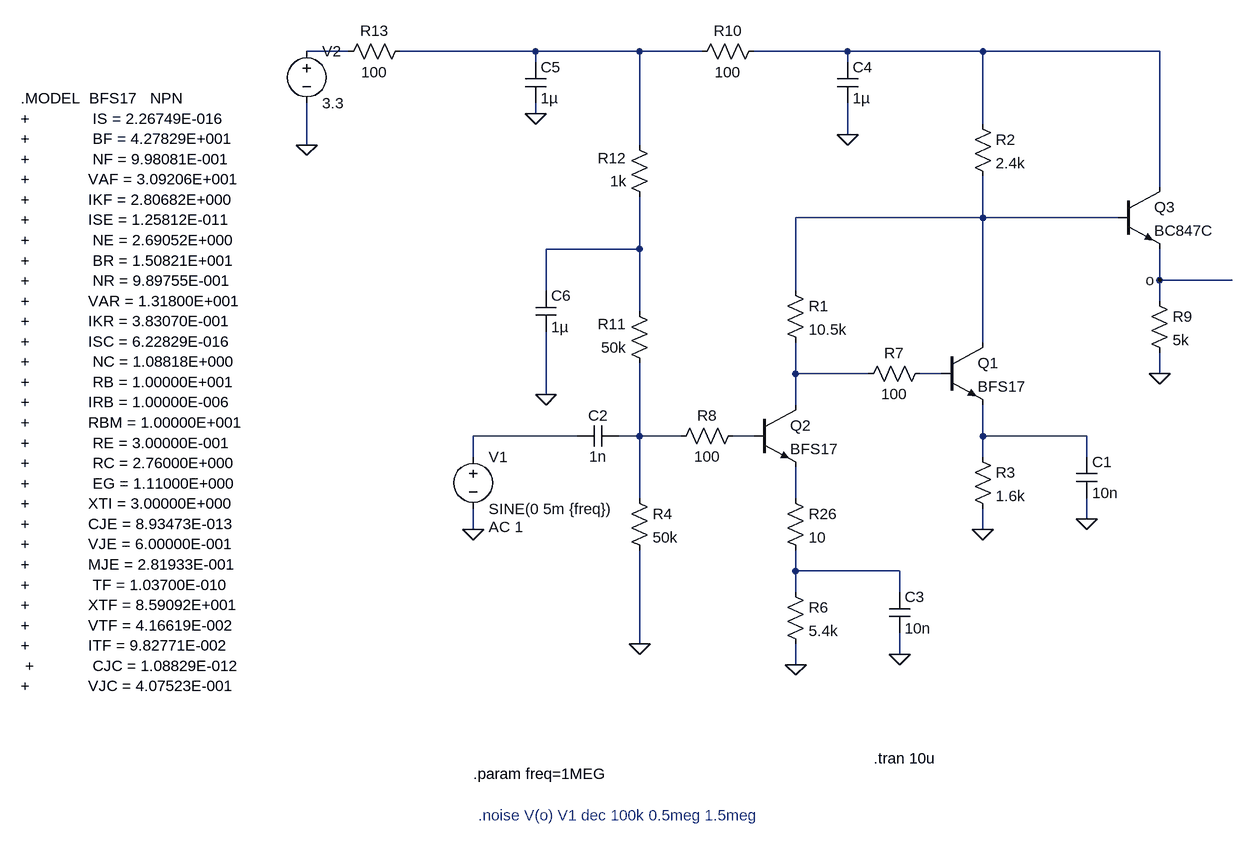
[diagram p0: schematic IsolationImprovedVersion3.asc]
IsolationImprovedVersion3.asc, the LTspice schematic file:
Version 4
SHEET 1 2740 712
WIRE -368 -480 -432 -480
WIRE -80 -480 -288 -480
WIRE 80 -480 -80 -480
WIRE 176 -480 80 -480
WIRE 400 -480 256 -480
WIRE 608 -480 400 -480
WIRE 880 -480 608 -480
WIRE -80 -464 -80 -480
WIRE 400 -464 400 -480
WIRE -80 -384 -80 -400
WIRE 608 -368 608 -480
WIRE 400 -352 400 -400
WIRE -432 -336 -432 -400
WIRE 80 -336 80 -480
WIRE 880 -272 880 -480
WIRE 608 -224 608 -288
WIRE 608 -224 320 -224
WIRE 816 -224 608 -224
WIRE 80 -176 80 -256
WIRE 80 -176 -64 -176
WIRE 880 -128 880 -176
WIRE 992 -128 880 -128
WIRE -64 -112 -64 -176
WIRE 320 -112 320 -224
WIRE 880 -96 880 -128
WIRE 80 -80 80 -176
WIRE 608 -32 608 -224
WIRE 320 16 320 -32
WIRE 432 16 320 16
WIRE 544 16 512 16
WIRE 880 16 880 -16
WIRE -64 48 -64 -48
WIRE 320 64 320 16
WIRE -16 112 -176 112
WIRE 80 112 80 0
WIRE 80 112 48 112
WIRE 144 112 80 112
WIRE 256 112 224 112
WIRE 608 112 608 64
WIRE 768 112 608 112
WIRE -176 144 -176 112
WIRE 608 144 608 112
WIRE 768 144 768 112
WIRE 80 208 80 112
WIRE 320 208 320 160
WIRE 768 240 768 208
WIRE -176 256 -176 224
WIRE 608 256 608 224
WIRE 320 320 320 288
WIRE 480 320 320 320
WIRE 320 352 320 320
WIRE 480 352 480 320
WIRE 80 432 80 288
WIRE 480 448 480 416
WIRE 320 464 320 432
FLAG 608 256 0
FLAG 768 240 0
FLAG 80 432 0
FLAG -176 256 0
FLAG 320 464 0
FLAG 480 448 0
FLAG 880 16 0
FLAG 400 -352 0
FLAG -64 48 0
FLAG -80 -384 0
FLAG -432 -336 0
FLAG 880 -128 o
SYMBOL res 304 -128 R0
SYMATTR InstName R1
SYMATTR Value 10.5k
SYMBOL npn 544 -32 R0
SYMATTR InstName Q1
SYMATTR Value BFS17
SYMBOL res 592 -384 R0
SYMATTR InstName R2
SYMATTR Value 2.4k
SYMBOL res 592 128 R0
SYMATTR InstName R3
SYMATTR Value 1.6k
SYMBOL cap 752 144 R0
SYMATTR InstName C1
SYMATTR Value 10n
SYMBOL res 64 192 R0
SYMATTR InstName R4
SYMATTR Value 50k
SYMBOL npn 256 64 R0
SYMATTR InstName Q2
SYMATTR Value BFS17
SYMBOL cap 48 96 R90
WINDOW 0 0 32 VBottom 2
WINDOW 3 32 32 VTop 2
SYMATTR InstName C2
SYMATTR Value 1n
SYMBOL res 304 336 R0
SYMATTR InstName R6
SYMATTR Value 5.4k
SYMBOL cap 464 352 R0
SYMATTR InstName C3
SYMATTR Value 10n
SYMBOL res 528 0 R90
WINDOW 0 0 56 VBottom 2
WINDOW 3 32 56 VTop 2
SYMATTR InstName R7
SYMATTR Value 100
SYMBOL res 240 96 R90
WINDOW 0 0 56 VBottom 2
WINDOW 3 32 56 VTop 2
SYMATTR InstName R8
SYMATTR Value 100
SYMBOL npn 816 -272 R0
SYMATTR InstName Q3
SYMATTR Value BC847C
SYMBOL res 864 -112 R0
SYMATTR InstName R9
SYMATTR Value 5k
SYMBOL res 272 -496 R90
WINDOW 0 0 56 VBottom 2
WINDOW 3 32 56 VTop 2
SYMATTR InstName R10
SYMATTR Value 100
SYMBOL res 96 16 R180
WINDOW 0 36 76 Left 2
WINDOW 3 36 40 Left 2
SYMATTR InstName R11
SYMATTR Value 50k
SYMATTR SpiceLine tol=50k
SYMBOL res 96 -240 R180
WINDOW 0 36 76 Left 2
WINDOW 3 36 40 Left 2
SYMATTR InstName R12
SYMATTR Value 1k
SYMBOL cap 384 -464 R0
SYMATTR InstName C4
SYMATTR Value 1µ
SYMBOL cap -96 -464 R0
SYMATTR InstName C5
SYMATTR Value 1µ
SYMBOL cap -80 -112 R0
SYMATTR InstName C6
SYMATTR Value 1µ
SYMBOL res -272 -496 R90
WINDOW 0 0 56 VBottom 2
WINDOW 3 32 56 VTop 2
SYMATTR InstName R13
SYMATTR Value 100
SYMBOL voltage -432 -496 R0
WINDOW 123 0 0 Left 0
WINDOW 39 0 0 Left 0
SYMATTR InstName V2
SYMATTR Value 3.3
SYMBOL res 304 192 R0
SYMATTR InstName R26
SYMATTR Value 10
SYMBOL voltage -176 128 R0
WINDOW 123 24 124 Left 2
WINDOW 39 0 0 Left 0
SYMATTR Value2 AC 1
SYMATTR InstName V1
SYMATTR Value SINE(0 5m {freq})
TEXT -872 -408 Left 2 !.MODEL  BFS17   NPN\n+              IS = 2.26749E-016\n+              BF = 4.27829E+001\n+              NF = 9.98081E-001\n+             VAF = 3.09206E+001\n+             IKF = 2.80682E+000\n+             ISE = 1.25812E-011\n+              NE = 2.69052E+000\n+              BR = 1.50821E+001\n+              NR = 9.89755E-001\n+             VAR = 1.31800E+001\n+             IKR = 3.83070E-001\n+             ISC = 6.22829E-016\n+              NC = 1.08818E+000\n+              RB = 1.00000E+001\n+             IRB = 1.00000E-006\n+             RBM = 1.00000E+001\n+              RE = 3.00000E-001\n+              RC = 2.76000E+000\n+              EG = 1.11000E+000\n+             XTI = 3.00000E+000\n+             CJE = 8.93473E-013\n+             VJE = 6.00000E-001\n+             MJE = 2.81933E-001\n+              TF = 1.03700E-010\n+             XTF = 8.59092E+001\n+             VTF = 4.16619E-002\n+             ITF = 9.82771E-002\n +             CJC = 1.08829E-012\n+             VJC = 4.07523E-001
TEXT -168 696 Left 2 ;.noise V(o) V1 dec 100k 0.5meg 1.5meg
TEXT -176 632 Left 2 !.param freq=1MEG
TEXT 440 608 Left 2 !.tran 10u

The netlist it stands for:
* IsolationImprovedVersion3.asc
R1 N004 N006 10.5k
Q1 N004 N007 N011 0 BFS17
R2 N003 N004 2.4k
R3 N011 0 1.6k
C1 N011 0 10n
R4 N009 0 50k
Q2 N006 N010 N012 0 BFS17
C2 N009 N008 1n
R6 N013 0 5.4k
C3 N013 0 10n
R7 N007 N006 100
R8 N010 N009 100
Q3 N003 N004 o 0 BC847C
R9 o 0 5k
R10 N003 N002 100
R11 N009 N005 50k tol=50k
R12 N005 N002 1k
C4 N003 0 1µ
C5 N002 0 1µ
C6 N005 0 1µ
R13 N002 N001 100
V2 N001 0 3.3
R26 N012 N013 10
V1 N008 0 SINE(0 5m {freq}) AC 1
.model NPN NPN
.model PNP PNP
.lib standard.bjt
.MODEL  BFS17   NPN
+              IS = 2.26749E-016
+              BF = 4.27829E+001
+              NF = 9.98081E-001
+             VAF = 3.09206E+001
+             IKF = 2.80682E+000
+             ISE = 1.25812E-011
+              NE = 2.69052E+000
+              BR = 1.50821E+001
+              NR = 9.89755E-001
+             VAR = 1.31800E+001
+             IKR = 3.83070E-001
+             ISC = 6.22829E-016
+              NC = 1.08818E+000
+              RB = 1.00000E+001
+             IRB = 1.00000E-006
+             RBM = 1.00000E+001
+              RE = 3.00000E-001
+              RC = 2.76000E+000
+              EG = 1.11000E+000
+             XTI = 3.00000E+000
+             CJE = 8.93473E-013
+             VJE = 6.00000E-001
+             MJE = 2.81933E-001
+              TF = 1.03700E-010
+             XTF = 8.59092E+001
+             VTF = 4.16619E-002
+             ITF = 9.82771E-002
 +             CJC = 1.08829E-012
+             VJC = 4.07523E-001
* .noise V(o) V1 dec 100k 0.5meg 1.5meg
.param freq=1MEG
.tran 10u
.backanno
.end